# Altium schematic sheet MotorDriversUnit.SchDoc: Teknofest Project
size 381 x 241 mm; SheetNumber: 4; SheetTotal: 4; Prepared by: Mustafa Oğuz ATEŞ
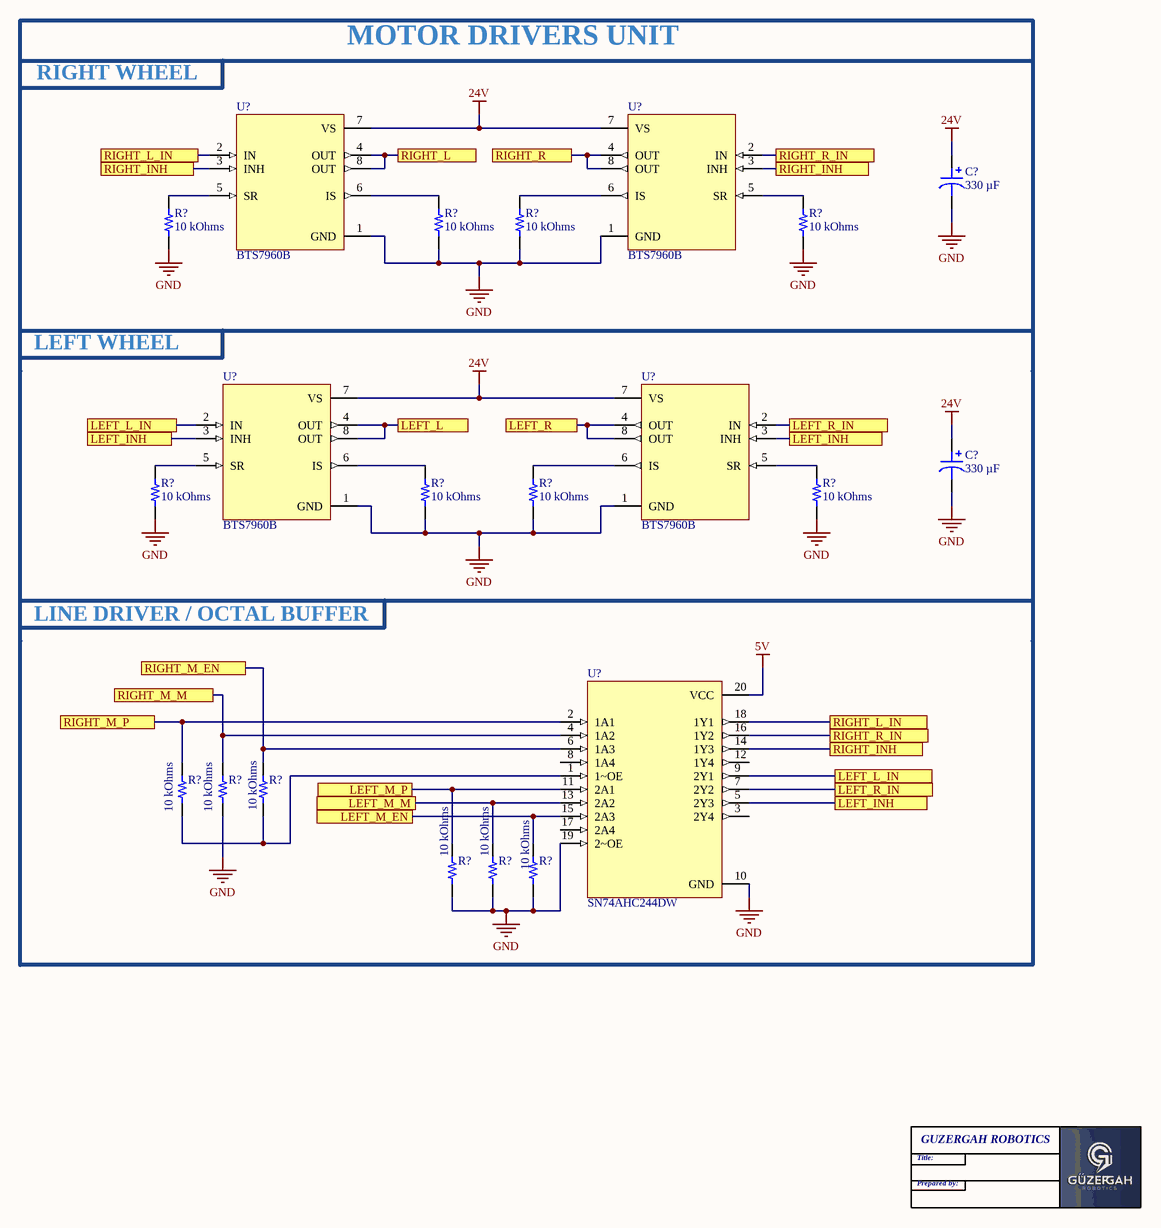
[diagram p0: MotorDriversUnit.SchDoc]

## Parts
(Parts that share a designator on the sheet are numbered #1, #2 ... from top to bottom, then left to right.)
C?#1  330 µF  [CAP ALSMD POLY 8.3MM H10.5MM]
C?#2  330 µF  [CAP ALSMD POLY 8.3MM H10.5MM]
R?#1  10 kOhms  [RES 1206_3216]
R?#2  10 kOhms  [RES 1206_3216]
R?#3  10 kOhms  [RES 1206_3216]
R?#4  10 kOhms  [RES 1206_3216]
R?#5  10 kOhms  [RES 1206_3216]
R?#6  10 kOhms  [RES 1206_3216]
R?#7  10 kOhms  [RES 1206_3216]
R?#8  10 kOhms  [RES 1206_3216]
R?#9  10 kOhms  [RES 1206_3216]
R?#10  10 kOhms  [RES 1206_3216]
R?#11  10 kOhms  [RES 1206_3216]
R?#12  10 kOhms  [RES 1206_3216]
R?#13  10 kOhms  [RES 1206_3216]
R?#14  10 kOhms  [RES 1206_3216]
U?#1  BTS7960B  [DPAK127P1490X440-8N]
U?#2  BTS7960B  [DPAK127P1490X440-8N]
U?#3  BTS7960B  [DPAK127P1490X440-8N]
U?#4  BTS7960B  [DPAK127P1490X440-8N]
U?#5  SN74AHC244DW  [SOIC127P1030X265-20N]

## Ports
LEFT_INH, LEFT_L, LEFT_L_IN, LEFT_M_EN, LEFT_M_M, LEFT_M_P, LEFT_R, LEFT_R_IN, RIGHT_INH, RIGHT_L, RIGHT_L_IN, RIGHT_M_EN, RIGHT_M_M, RIGHT_M_P, RIGHT_R, RIGHT_R_IN

## Nets
5V: U?#5.20(VCC)
24V: C?#1.1 C?#2.1 U?#1.7(VS) U?#2.7(VS) U?#3.7(VS) U?#4.7(VS)
GND: C?#1.2 C?#2.2 R?#1.2 R?#2.2 R?#3.2 R?#4.2 R?#5.2 R?#6.2 R?#7.2 R?#8.2 R?#10.2 R?#12.2 R?#13.2 R?#14.2 U?#1.1(GND) U?#2.1(GND) U?#3.1(GND) U?#4.1(GND) U?#5.10(GND) U?#5.19(2~OE)
LEFT_INH: U?#3.3(INH) U?#4.3(INH) U?#5.5(2Y3) ; port LEFT_INH
LEFT_L: U?#3.4(OUT) U?#3.8(OUT) ; port LEFT_L
LEFT_L_IN: U?#3.2(IN) U?#5.9(2Y1) ; port LEFT_L_IN
LEFT_M_EN: R?#14.1 U?#5.15(2A3) ; port LEFT_M_EN
LEFT_M_M: R?#13.1 U?#5.13(2A2) ; port LEFT_M_M
LEFT_M_P: R?#12.1 U?#5.11(2A1) ; port LEFT_M_P
LEFT_R: U?#4.4(OUT) U?#4.8(OUT) ; port LEFT_R
LEFT_R_IN: U?#4.2(IN) U?#5.7(2Y2) ; port LEFT_R_IN
RIGHT_INH: U?#1.3(INH) U?#2.3(INH) U?#5.14(1Y3) ; port RIGHT_INH
RIGHT_L: U?#1.4(OUT) U?#1.8(OUT) ; port RIGHT_L
RIGHT_L_IN: U?#1.2(IN) U?#5.18(1Y1) ; port RIGHT_L_IN
RIGHT_M_EN: R?#11.1 U?#5.6(1A3) ; port RIGHT_M_EN
RIGHT_M_M: R?#10.1 U?#5.4(1A2) ; port RIGHT_M_M
RIGHT_M_P: R?#9.1 U?#5.2(1A1) ; port RIGHT_M_P
RIGHT_R: U?#2.4(OUT) U?#2.8(OUT) ; port RIGHT_R
RIGHT_R_IN: U?#2.2(IN) U?#5.16(1Y2) ; port RIGHT_R_IN
NetR?#1_1: R?#1.1 U?#1.5(SR)
NetR?#2_1: R?#2.1 U?#1.6(IS)
NetR?#3_1: R?#3.1 U?#2.6(IS)
NetR?#4_1: R?#4.1 U?#2.5(SR)
NetR?#5_1: R?#5.1 U?#3.5(SR)
NetR?#6_1: R?#6.1 U?#3.6(IS)
NetR?#7_1: R?#7.1 U?#4.6(IS)
NetR?#8_1: R?#8.1 U?#4.5(SR)
NetR?#9_2: R?#9.2 R?#11.2 U?#5.1(1~OE)

Not connected (* = marked no-connect by the designer): U?#5 3(2Y4) 8(1A4) 12(1Y4) 17(2A4)

## Notes on the sheet
- MOTOR DRIVERS UNIT
- RIGHT WHEEL
- LEFT WHEEL
- LINE DRIVER / OCTAL BUFFER
- Title:
- Prepared by:
- GUZERGAH ROBOTICS

## Library data of the parts
C?#1 C?#2 = 25PKV330M8X10.5: CAP ALUM HYB 330UF 20% 25V SMD; manufacturer: Rubycon; ESR (Equivalent Series Resistance): 22mOhm; Lifetime @ Temp.: 4000 Hrs @ 125°C; Ripple Current @ High Frequency: 2 A @ 100 kHz; Ripple Current @ Low Frequency: 300 mA @ 100 Hz; Surface Mount Land Size: 0.327" L x 0.327" W (8.30mm x 8.30mm); Type: Hybrid; Part Number: 25PKV330M8X10.5; Applications: Automotive; Capacitance: 330 µF; componentlink1description: Datasheet; componentlink1url: https://www.rubycon.co.jp/wp-content/uploads/catalog-hybrid/PKV.pdf; componentlink2description: DigiKey Link; componentlink2url: https://www.digikey.com/en/products/detail/rubycon/25PKV330M8X10-5/17952146; Height - Seated (Max): 0.413" (10.50mm); lastupdated: 3.06.2024 20:17:02; Lifecycle Status: Active; Minimum Order: 1; Mounting Type: Surface Mount; Operating Temperature: -55°C ~ 125°C; packaging: TapeAndReel; partid: 5755; price: 0.65; Ratings: AEC-Q200; series: PKV; Size / Dimension: 0.315" Dia (8.00mm); Supplier 1: DigiKey; Supplier Part Number 1: 1189-25PKV330M8X10.5CT-ND; Tolerance: ±20%; value: 330 µF; Voltage - Rated: 25 V
R?#1-R?#14 = CR1206AFX-1002EAS: RESA-AS 1206 10K 1% 250MW TC100; Manufacturer: Bourns Inc.; Power (Watts): 0.25W, 1/4W; Temperature Coefficient: ±100ppm/°C; Part Number: CR1206AFX-1002EAS; ComponentLink1Description: Datasheet; ComponentLink1URL: //media.digikey.com/pdf/Data%20Sheets/Bourns%20PDFs/CRyyyyA-AS_Model_DS.pdf; ComponentLink2Description: DigiKey Link; ComponentLink2URL: https://www.digikey.com/en/products/detail/bourns-inc/CR1206AFX-1002EAS/10240135; Composition: Thick Film; Device Package: 1206 (3216 Metric); Features: Anti-Sulfur, Automotive AEC-Q200, Moisture Resistant; Height - Seated (Max): 0.026" (0.65mm); LastUpdated: 25.12.2023 20:50:47; Lifecycle Status: Active; Minimum Order: 1; Number of Terminations: 2; Operating Temperature: -55°C ~ 155°C; Package / Case: 1206 (3216 Metric); Packaging: TapeAndReel; PartId: 26960; Part Status: Active; Price: 0.01; Ratings: AEC-Q200; Resistance: 10 kOhms; Series: CR1206A-AS; Size / Dimension: 0.122" L x 0.061" W (3.10mm x 1.55mm); Supplier 1: DigiKey; Supplier Part Number 1: 118-CR1206AFX-1002EASCT-ND; Supplier Device Package: 1206; Tolerance: ±1%; Value: 10 kOhms
U?#5 = SN74AHC244DW: IC BUFFER INVERT 5.5V 20SOIC